# Altium project Module_ConMic(with gain).PrjPCB
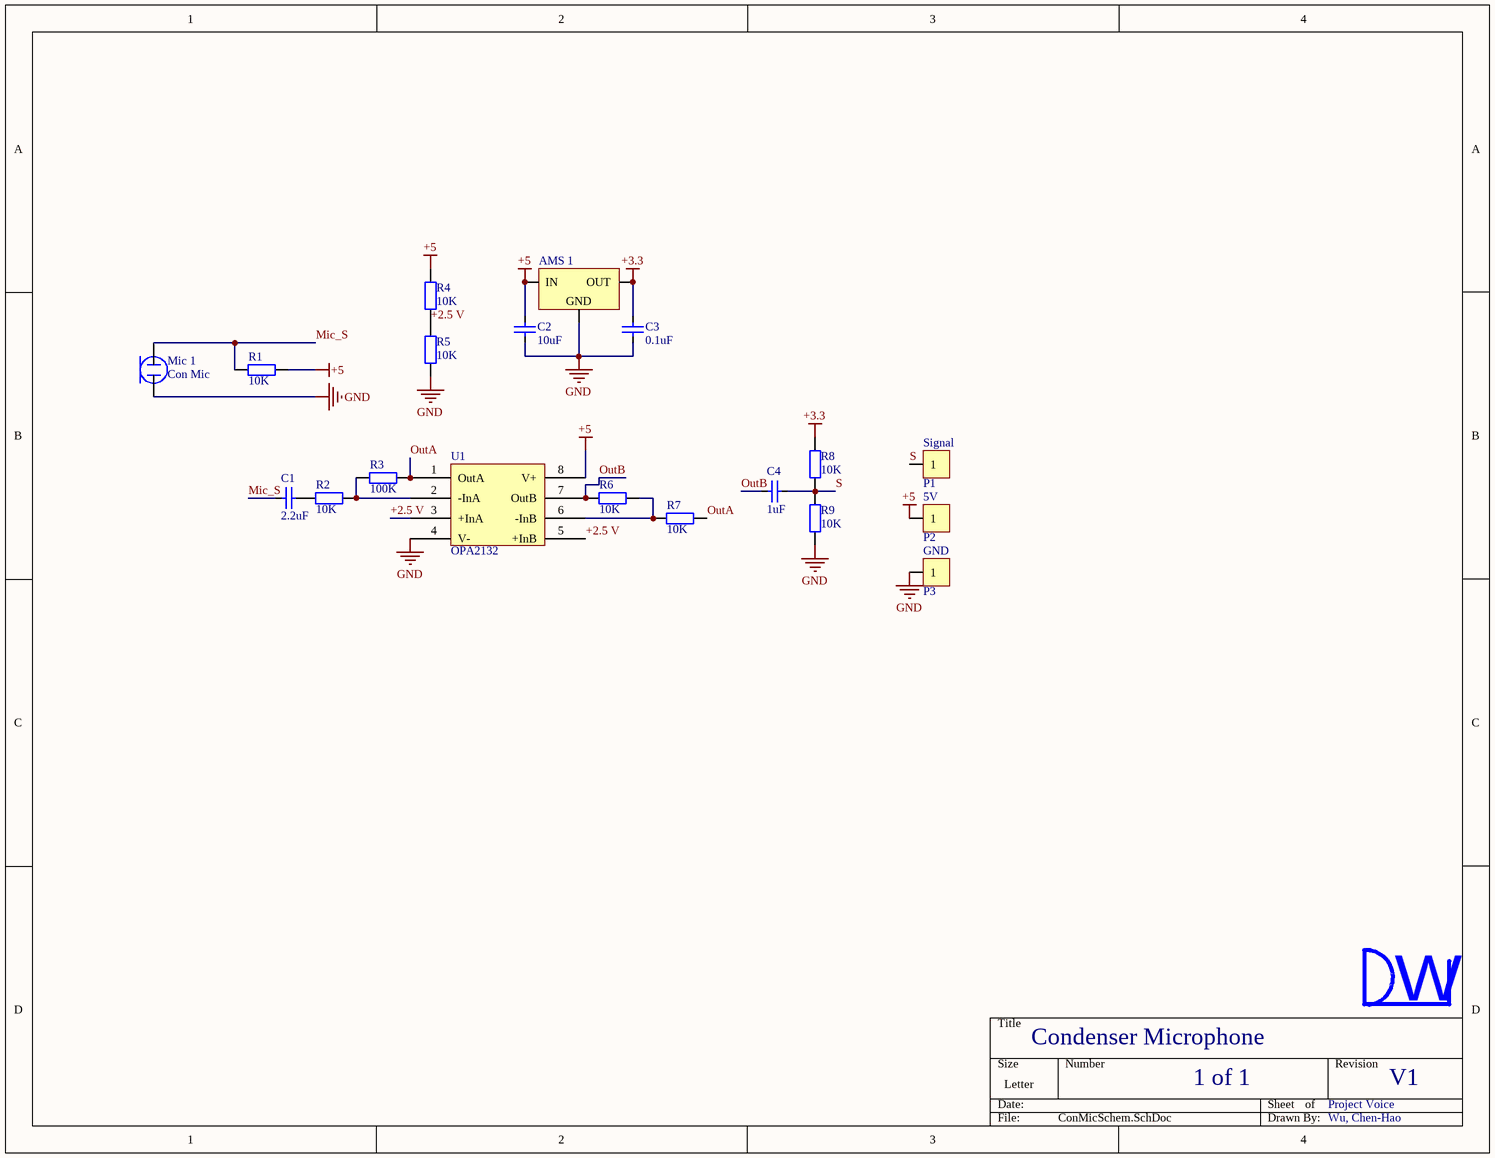
[diagram p0: ConMicSchem.SchDoc]
1 sheet, 20 parts. Net scope: global (net labels, ports and power ports of the same name join across sheets).
Board file: ModuleConMicPCB.PcbDoc

## Sheet ConMicSchem.SchDoc
size Letter

### Parts
*  DHW_MARK  (value not drawn)
AMS_1  AMS1117  [SOT223]  (value not drawn)
C1  value 2.2uF  [CAP_0603]  (hidden comment: Cap_0603)
C2  value 10uF  [CAP_0603]  (hidden comment: Cap_0603)
C3  value 0.1uF  [CAP_0603]  (hidden comment: Cap_0603)
C4  value 1uF  [CAP_0603]  (hidden comment: Cap_0603)
Mic_1  Con Mic  [Con_Mic_9.6mm]
P1  Signal  [HDR1X1_180_2.54]
P2  5V  [HDR1X1_180_2.54]
P3  GND  [HDR1X1_180_2.54]
R1  value 10K  [RES_0603]  (hidden comment: Res_0603)
R2  value 10K  [RES_0603]  (hidden comment: Res_0603)
R3  value 100K  [RES_0603]  (hidden comment: Res_0603)
R4  value 10K  [RES_0603]  (hidden comment: Res_0603)
R5  value 10K  [RES_0603]  (hidden comment: Res_0603)
R6  value 10K  [RES_0603]  (hidden comment: Res_0603)
R7  value 10K  [RES_0603]  (hidden comment: Res_0603)
R8  value 10K  [RES_0603]  (hidden comment: Res_0603)
R9  value 10K  [RES_0603]  (hidden comment: Res_0603)
U1  OPA2132  [DIP_8]

### Nets
+3.3: AMS_1.2(OUT) C3.2 R8.2
+5: AMS_1.3(IN) C2.2 P2.1 R1.2 R4.2 U1.8(V+)
GND: AMS_1.1(GND) C2.1 C3.1 Mic_1.2(RigidPlat) P3.1 R5.1 R9.1 U1.4(V-)
+2.5 V: R4.1 R5.2 U1.3(+InA) U1.5(+InB)
Mic_S: C1.1 Mic_1.1(FlexiblePlat) R1.1
OutA: R3.2 R7.2 U1.1(OutA)
OutB: C4.2 R6.1 U1.7(OutB)
S: C4.1 P1.1 R8.1 R9.2
NetC1_2: C1.2 R2.1
NetR2_2: R2.2 R3.1 U1.2(-InA)
NetR6_2: R6.2 R7.1 U1.6(-InB)

### Notes on the sheet
- Condenser Microphone
- 1 of 1
- Project Voice
- V1
- Wu, Chen-Hao
- (in symbol DHW_MARK) W

### Library data of the parts
AMS_1 = AMS1117: Power
C1-C4 = Cap_0603: Capacitor
Mic_1 = Con_Mic_9.7mm: Condenser Microphone
P1-P3 = HDR1X1_180_2.54: Header
R1-R9 = Res_0603: Resistor
U1 = OPA2132: TI BB OPA2132 - 2 op amps IC